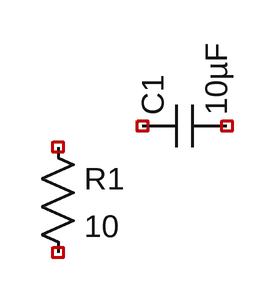
[diagram p0: schematic testcirc.asc]
testcirc.asc, the LTspice schematic file:
Version 4
SHEET 1 880 680
SYMBOL res 16 96 R0
SYMATTR InstName R1
SYMATTR Value 10
SYMBOL cap 96 112 R270
SYMATTR InstName C1
SYMATTR Value 10µF

The netlist it stands for:
* testcirc.asc
R1 NC_01 NC_02 10
C1 NC_03 NC_04 10µF
.backanno
.end